# Altium schematic sheet LED_RED_0603x8.SCHDOC: 8-Way 0603 Red LED Array
size A4; Organization: Altium Limited.; Address1: Level 3, 12a Rodborough Rd; Address2: Frenchs Forest 2086; Address3: NSW; Address4: AUSTRALIA; Revision: 6; SheetNumber: 25; SheetTotal: 64; PageSetup: Record=PageOptions|CenterHorizontal=True|CenterVertical=True|PrintScale=0.97|XCorrection=1.00|YCorrection=1.00|PrintKind=0|BorderSize=5000000|LeftOffset=0|BottomOffset=0|Orientation=2|PaperLength=1000|PaperWidth=1000|Scale=100|PaperSource=7|PrintQuality=-4|MediaType=1|DitherType=10|PaperKind=A4 (210 x 297mm)|PrintScaleMode=1
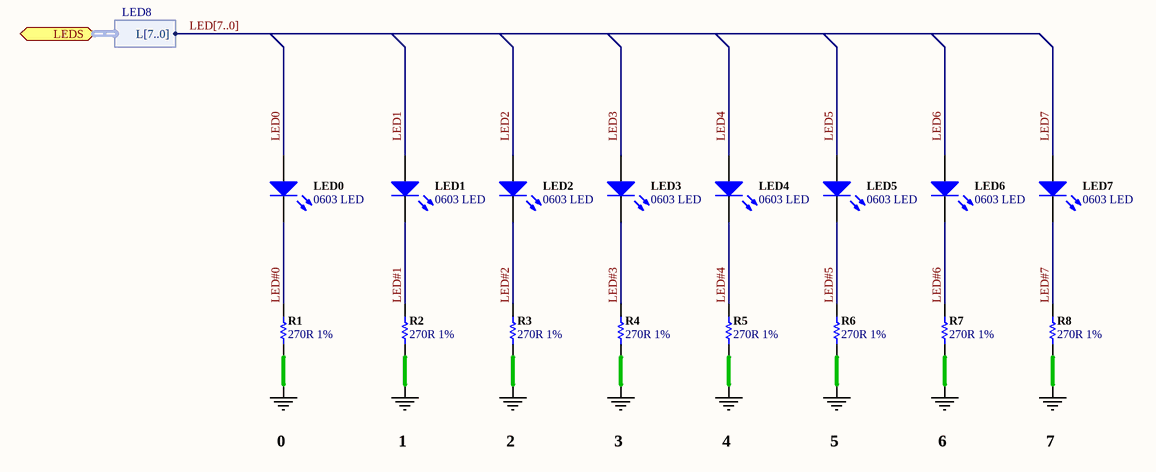
[diagram p0: LED_RED_0603x8.SCHDOC]

## Parts
LED0  0603 LED  [0603LED]
LED1  0603 LED  [0603LED]
LED2  0603 LED  [0603LED]
LED3  0603 LED  [0603LED]
LED4  0603 LED  [0603LED]
LED5  0603 LED  [0603LED]
LED6  0603 LED  [0603LED]
LED7  0603 LED  [0603LED]
R1  270R 1%  [RESC1005-STAR]
R2  270R 1%  [RESC1005-STAR]
R3  270R 1%  [RESC1005-STAR]
R4  270R 1%  [RESC1005-STAR]
R5  270R 1%  [RESC1005-STAR]
R6  270R 1%  [RESC1005-STAR]
R7  270R 1%  [RESC1005-STAR]
R8  270R 1%  [RESC1005-STAR]

## Ports
LEDS (harness LED8)

## Harnesses
LED8: L[7..0]

## Nets
GND: R1.1 R2.1 R3.1 R4.1 R5.1 R6.1 R7.1 R8.1
LED0: LED0.1(A)
LED1: LED1.1(A)
LED2: LED2.1(A)
LED3: LED3.1(A)
LED4: LED4.1(A)
LED5: LED5.1(A)
LED6: LED6.1(A)
LED7: LED7.1(A)
LED#0: LED0.2(K) R1.2
LED#1: LED1.2(K) R2.2
LED#2: LED2.2(K) R3.2
LED#3: LED3.2(K) R4.2
LED#4: LED4.2(K) R5.2
LED#5: LED5.2(K) R6.2
LED#6: LED6.2(K) R7.2
LED#7: LED7.2(K) R8.2

## Buses and harness runs
bus LED[7..0]

## Notes on the sheet
- 0
- 1
- 2
- 3
- 4
- 5
- 6
- 7
- Sheet Title
- Project Title
- Size:
- Date:
- A4
- Assy:
- Time:
- Sheet
- Revision:
- of
- File:

## Library data of the parts
LED0-LED7 = D-153-0009: LED, Red 0603 (1608) 63mCd; Peak Wave Length: 630 nm; Category: LED; Brightness: 63 mcd; Color: Red; Mounting Technology: Surface Mount; Status: Unreleased
R1-R8 = D-100-0111: Resistor, 270R 1% 0402 (1005); Power Rating: 63 mW; Category: Resistor; Mounting Technology: Surface Mount; Resistance: 270 R; Status: Production; Tolerance: 1 %